# Altium schematic sheet RF Antenna.SchDoc: RF Antenna
size A4; Date: Dec. 26th, 2022; Author: Karl Asseily; DrawnBy: Karl Asseily; DocumentNumber: 202301140903; Revision: 1.2; SheetNumber: 15; SheetTotal: 20
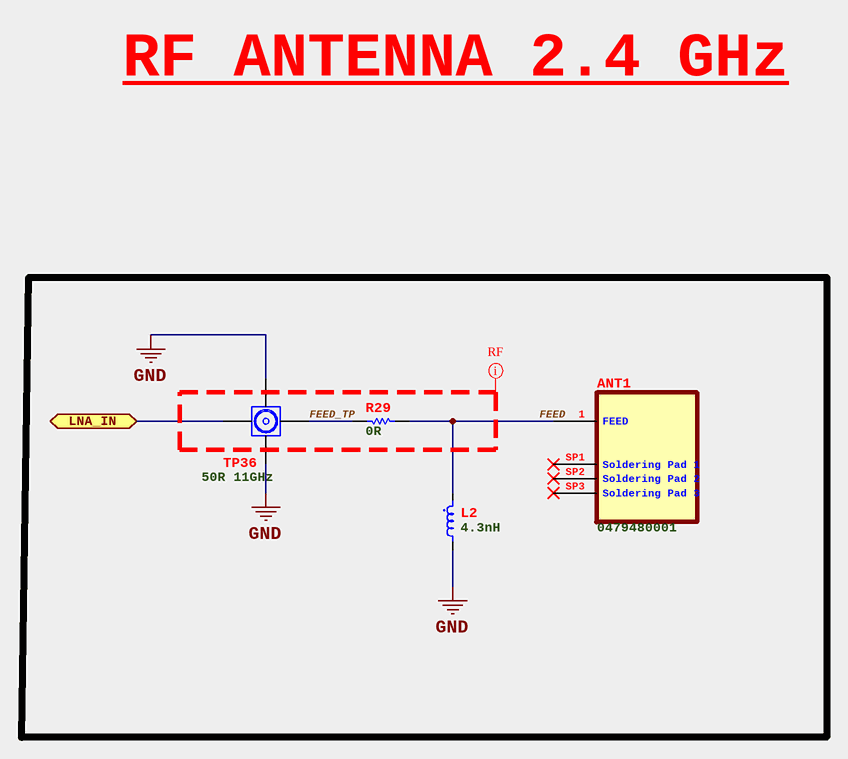
[diagram p0: RF Antenna.SchDoc]

## Parts
ANT1  0479480001  [ANT_MOLEX_0479480001]
L2  4.3nH  [IND_0402]
R29  0R  [RES_0603]
TP36  50R 11GHz  [CON-RCPT_U.FL_MM8030-2610RJ3]

## Ports
LNA_IN (bidir, see Main Controller Unit, ESP32 Processor)

## Nets
GND: L2.2 TP36.3(GND) TP36.4(GND)
FEED: ANT1.1(FEED) L2.1 R29.1
FEED_TP: R29.2 TP36.1(IN)
LNA_IN: TP36.2(OUT) ; port LNA_IN

Not connected (* = marked no-connect by the designer): ANT1 SP1(Soldering_Pad_1)* SP2(Soldering_Pad_2)* SP3(Soldering_Pad_3)*

## Layout directives
net class RF; rule Maximum Via Count Constraint [Max Count = 0]; rule Impedance Constraint [Min = 49.50    Max = 50.50    ]; rule Daisy Chain Stub Length [Limit = 0mil]: FEED_TP

## Notes on the sheet
- RF ANTENNA 2.4 GHz
- Project
- Sheet
- Size
- Filename
- A4
- of
- Number
- Drawn By
- Rev.
- Variant
- Date

## Library data of the parts
ANT1 = ANT_0479480001: 2.4GHz Bluetooth, WLAN, Zigbee™ Chip RF Antenna 2.4GHz ~ 2.483.5GHz 3dBi Solder Surface Mount; Manufacturer: Molex; Supplier 1: Digi-Key; Manufacturer Part Number: 0479480001; RoHS: Yes; Category: Uncategorized; Stock 1: 24488; Pricing 1: 1=1.95000, 10=1.75600, 25=1.65640, 100=1.41130, 250=1.32520, 500=1.15956 (USD); Supplier 2: Mouser; Supplier Part Number 1: WM4893CT-ND; Supplier Part Number 2: 538-47948-0001; ComponentLink4Description: Application Specification; ComponentLink4URL: C:\Users\Public\Documents\Altium\Projects\Cellar_Watchdog\Docs\Antenna\AS-47948-001-001.pdf; ComponentLink5Description: Product Specification; ComponentLink5URL: C:\Users\Public\Documents\Altium\Projects\Cellar_Watchdog\Docs\Antenna\PS-47948-001-001.pdf; ComponentLink6Description: Product Design Drawing; ComponentLink6URL: C:\Users\Public\Documents\Altium\Projects\Cellar_Watchdog\Docs\Antenna\479480001_sd.pdf
L2 = IND_4.3nH-750mA-2%_0402: 4.3 nH Unshielded Multilayer Inductor 750 mA 140mOhm Max 0402 (1005 Metric); Manufacturer: Murata; Manufacturer Part Number: LQG15HS4N3B02D; Supplier 1: Digi-Key; RoHS: Yes; Category: Fixed Inductors; Stock 1: 29910; Pricing 1: 1=0.10000, 10=0.07700, 25=0.06880, 50=0.05840, 100=0.05150, 250=0.04720, 500=0.04292, 1000=0.03606, 2500=0.03090 (USD); Supplier 2: Mouser; Inductance: 4.3nH; Supplier Part Number 1: 490-LQG15HS4N3B02DCT-ND; Supplier Part Number 2: 81-LQG15HS4N3B02D; ComponentLink1Description: Datasheet; ComponentLink1URL: C:\Users\Public\Documents\Altium\Projects\Cellar_Watchdog\Docs\Inductor\JELF243B-0009.pdf
R29 = RES_0R-100mW-1%_0603: 0 Ohms Jumper Chip Resistor 0603 (1608 Metric) Moisture Resistant Thick Film; Manufacturer: Yageo; Manufacturer Part Number: RC0603FR-070RL; Power Rating: 100mW; Tolerance: 1%; Voltage Rating (DC): 50V; Temperature Coefficient: 200ppm/°C; Current Rating: 1A; Working Voltage: 75V; Supplier 1: Digi-Key; RoHS: Yes; Category: Chip SMD Resistors; Stock 1: 4158752; Pricing 1: 1=0.10000, 10=0.01800, 25=0.01320, 50=0.01000, 100=0.00730, 250=0.00560, 500=0.00448, 1000=0.00329 (USD); Case/Package: 0603; Number of Pins: 2; Contact Plating: Tin,Matte; Case Code (Metric): 1608; Case Code (Imperial): 0603; Min Operating Temperature: -55°C; Max Operating Temperature: 155°C; Resistance: 0R; Packaging: Tape and Reel; Resistor Type: Thick Film; Package Quantity: 5000; Voltage Rating: 50V; Number of Terminations: 2; Termination: SMD/SMT; Max Power Dissipation: 100mW; Features: Moisture Resistant; Series: RC; Construction: Rectangular; Resistance Tolerance: 1%; Technology: THICK FILM; Length: 1.6mm; Width: 0.8mm; Height: 0.45mm; Depth: 0.8mm; Radiation Hardening: No; Reach SVHC Compliant: Yes; Lead Free: Lead Free; RoHS Compliant: Yes; Military Standard: Not; ComponentLink7URL: C:\Users\Public\Documents\Altium\Projects\Cellar_Watchdog\Docs\Resistor\PYu-RC_Group_51_RoHS_L_12.pdf; ComponentLink7Description: Datasheet; Supplier 2: Mouser; Supplier Part Number 2: 603-RC0603FR-070RL; Supplier Part Number 1: 311-0.0HRCT-ND
TP36 = CON-RCPT_U.FL-MM8030-2610RJ3: SWG Connector Receptacle, Female Socket 50Ohm Surface Mount Solder; Manufacturer: Murata; Body Material: Copper; Voltage Rating: 250V; Polarity: Standard; Insulation Resistance: 500MR; Operating Frequency: 0 to 11 GHz; Supplier 1: Digi-Key; Manufacturer Part Number: MM8030-2610RJ3; RoHS: No; Category: RF / Coaxial Connectors; Stock 1: 124387; Pricing 1: 1=0.18000, 10=0.15300, 25=0.13600, 50=0.12700, 100=0.11790, 250=0.10432, 500=0.09976, 1000=0.08163 (USD); Mounting Technology: Surface Mount; Case/Package: SMD/SMT; Contact Plating: Gold; Housing Color: Gold; Min Operating Temperature: -40°C; Max Operating Temperature: 85°C; Package Quantity: 1; Impedance: 50R; Fastening Type: Pull; Packaging: Tape and Reel; Termination: Solder; Clock Frequency: 11GHz; Frequency: 11GHz; Connector Type: Socket; Orientation: Straight; Series: 8030; Length: 2.1mm; Depth: 2mm; Lead Free: Lead Free; RoHS Compliant: No; ComponentLink1URL: C:\Users\Public\Documents\Altium\Projects\Cellar_Watchdog\Docs\Connector\Microwave_Coaxial_Conn_Cat030E.pdf; ComponentLink1Description: Datasheet; Supplier 2: Mouser; Supplier Part Number 2: 81-MM8030-2610RJ3; Supplier Part Number 1: 490-5907-1-ND; ClassName: Test Point